# Altium schematic sheet Sheet3.SchDoc
size A
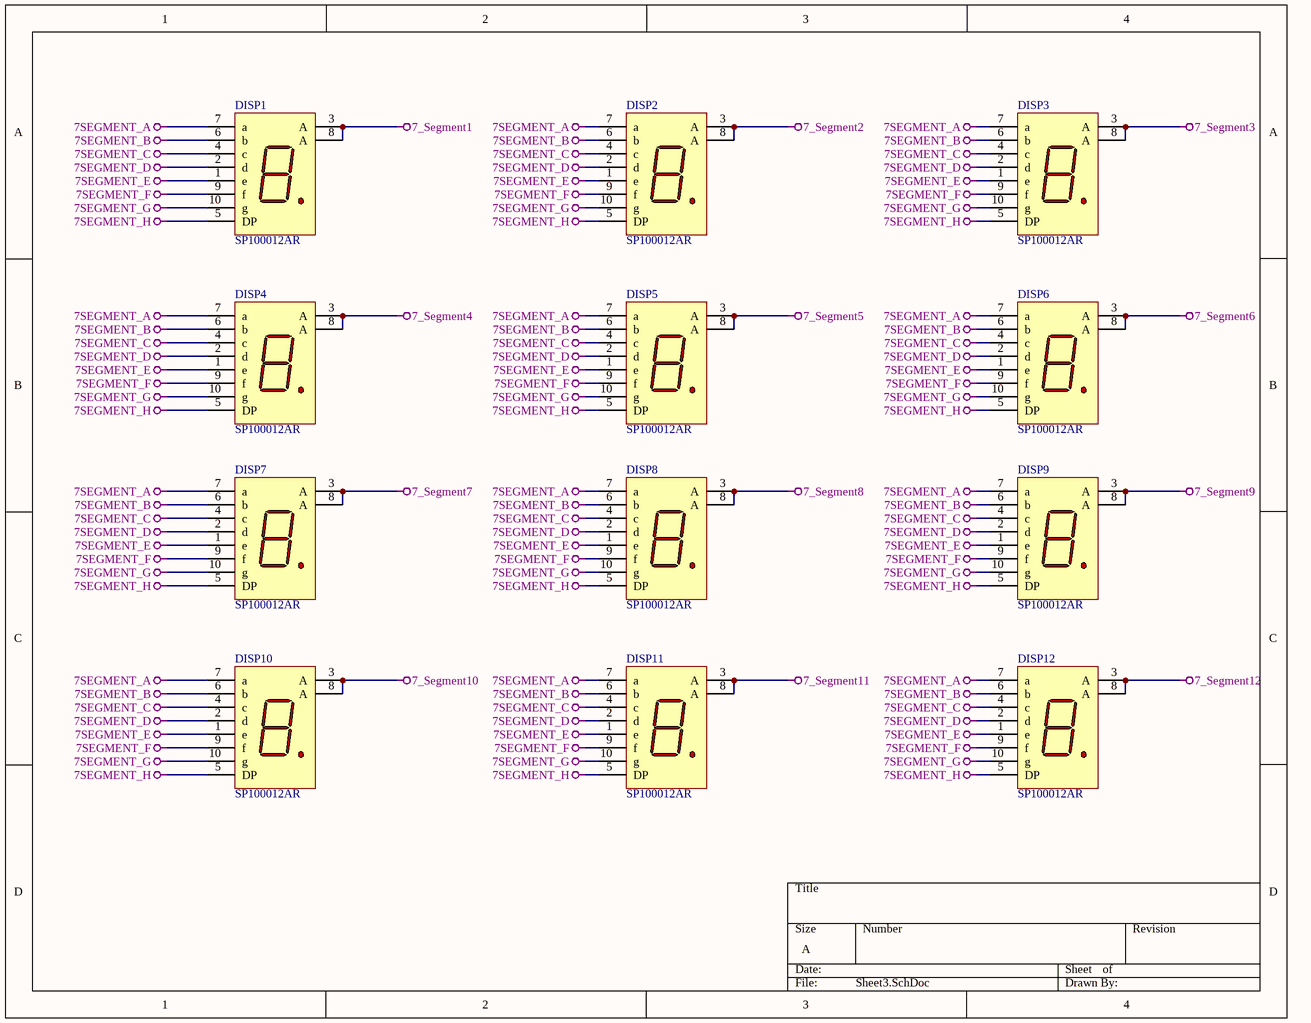
[diagram p0: Sheet3.SchDoc]

## Parts
DISP1  SP100012AR  [SP10012AR-HILIGHT]
DISP2  SP100012AR  [SP10012AR-HILIGHT]
DISP3  SP100012AR  [SP10012AR-HILIGHT]
DISP4  SP100012AR  [SP10012AR-HILIGHT]
DISP5  SP100012AR  [SP10012AR-HILIGHT]
DISP6  SP100012AR  [SP10012AR-HILIGHT]
DISP7  SP100012AR  [SP10012AR-HILIGHT]
DISP8  SP100012AR  [SP10012AR-HILIGHT]
DISP9  SP100012AR  [SP10012AR-HILIGHT]
DISP10  SP100012AR  [SP10012AR-HILIGHT]
DISP11  SP100012AR  [SP10012AR-HILIGHT]
DISP12  SP100012AR  [SP10012AR-HILIGHT]

## Nets
7_Segment1: DISP1.3(A) DISP1.8(A)
7_Segment2: DISP2.3(A) DISP2.8(A)
7_Segment3: DISP3.3(A) DISP3.8(A)
7_Segment4: DISP4.3(A) DISP4.8(A)
7_Segment5: DISP5.3(A) DISP5.8(A)
7_Segment6: DISP6.3(A) DISP6.8(A)
7_Segment7: DISP7.3(A) DISP7.8(A)
7_Segment8: DISP8.3(A) DISP8.8(A)
7_Segment9: DISP9.3(A) DISP9.8(A)
7_Segment10: DISP10.3(A) DISP10.8(A)
7_Segment11: DISP11.3(A) DISP11.8(A)
7_Segment12: DISP12.3(A) DISP12.8(A)
7SEGMENT_A: DISP1.7(a) DISP2.7(a) DISP3.7(a) DISP4.7(a) DISP5.7(a) DISP6.7(a) DISP7.7(a) DISP8.7(a) DISP9.7(a) DISP10.7(a) DISP11.7(a) DISP12.7(a)
7SEGMENT_B: DISP1.6(b) DISP2.6(b) DISP3.6(b) DISP4.6(b) DISP5.6(b) DISP6.6(b) DISP7.6(b) DISP8.6(b) DISP9.6(b) DISP10.6(b) DISP11.6(b) DISP12.6(b)
7SEGMENT_C: DISP1.4(c) DISP2.4(c) DISP3.4(c) DISP4.4(c) DISP5.4(c) DISP6.4(c) DISP7.4(c) DISP8.4(c) DISP9.4(c) DISP10.4(c) DISP11.4(c) DISP12.4(c)
7SEGMENT_D: DISP1.2(d) DISP2.2(d) DISP3.2(d) DISP4.2(d) DISP5.2(d) DISP6.2(d) DISP7.2(d) DISP8.2(d) DISP9.2(d) DISP10.2(d) DISP11.2(d) DISP12.2(d)
7SEGMENT_E: DISP1.1(e) DISP2.1(e) DISP3.1(e) DISP4.1(e) DISP5.1(e) DISP6.1(e) DISP7.1(e) DISP8.1(e) DISP9.1(e) DISP10.1(e) DISP11.1(e) DISP12.1(e)
7SEGMENT_F: DISP1.9(f) DISP2.9(f) DISP3.9(f) DISP4.9(f) DISP5.9(f) DISP6.9(f) DISP7.9(f) DISP8.9(f) DISP9.9(f) DISP10.9(f) DISP11.9(f) DISP12.9(f)
7SEGMENT_G: DISP1.10(g) DISP2.10(g) DISP3.10(g) DISP4.10(g) DISP5.10(g) DISP6.10(g) DISP7.10(g) DISP8.10(g) DISP9.10(g) DISP10.10(g) DISP11.10(g) DISP12.10(g)
7SEGMENT_H: DISP1.5(DP) DISP2.5(DP) DISP3.5(DP) DISP4.5(DP) DISP5.5(DP) DISP6.5(DP) DISP7.5(DP) DISP8.5(DP) DISP9.5(DP) DISP10.5(DP) DISP11.5(DP) DISP12.5(DP)

## Library data of the parts
DISP1-DISP12 = SP100012AR: 34mm/1200mil